# Altium schematic sheet FPGA_IO.SchDoc
size A3
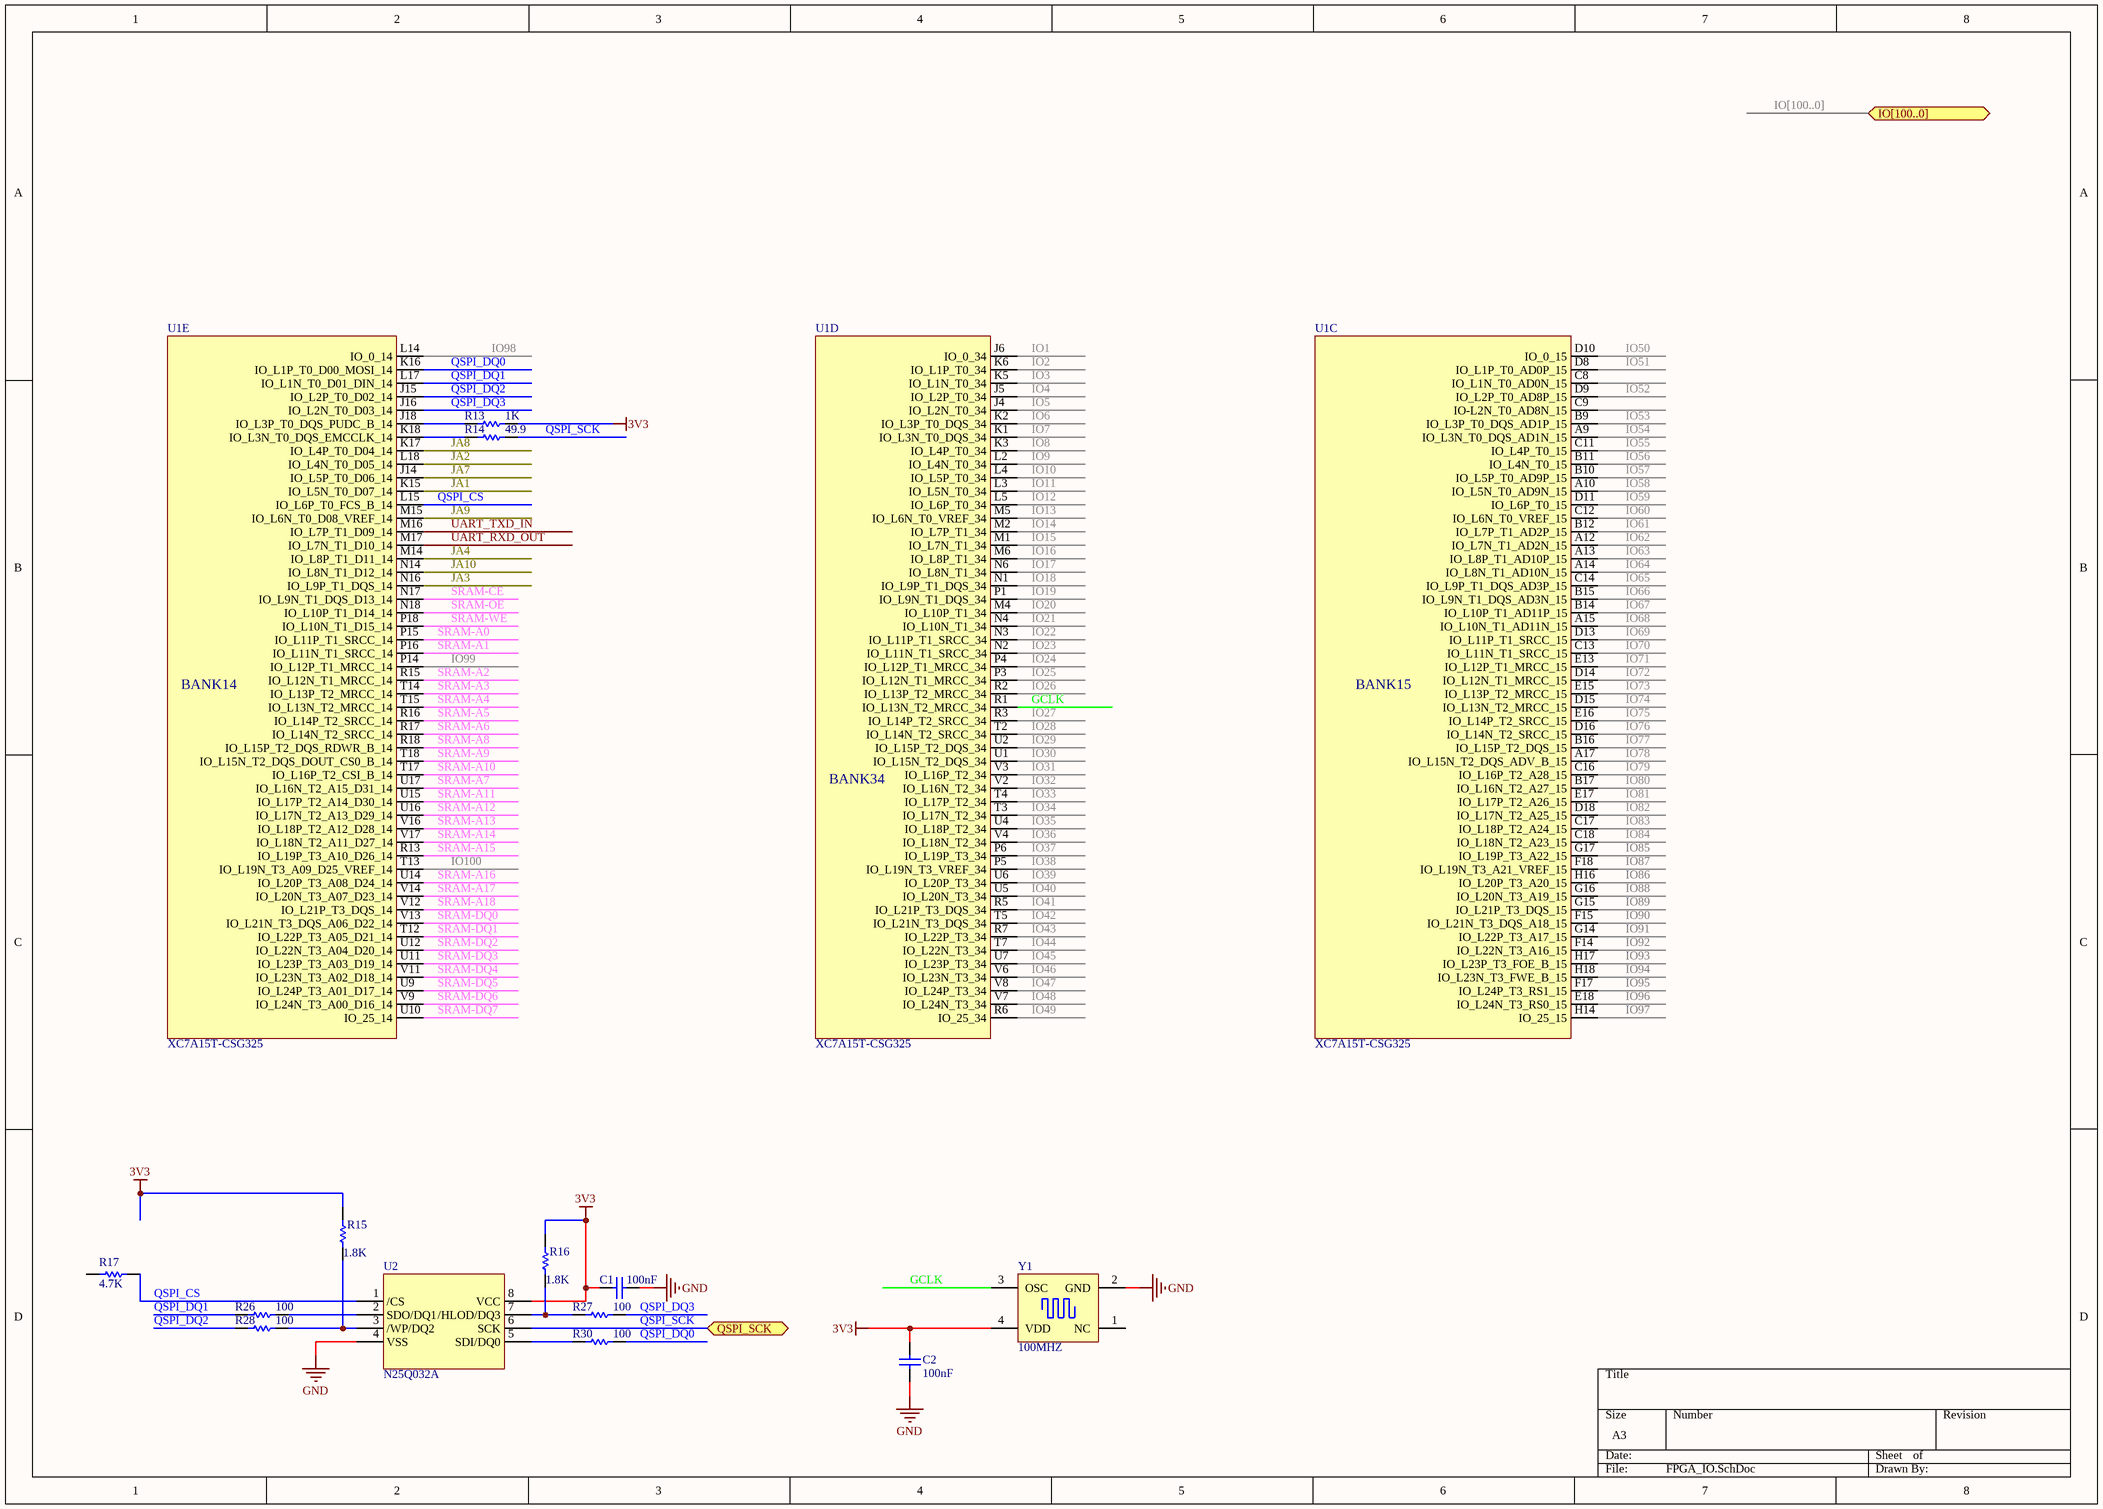
[diagram p0: FPGA_IO.SchDoc]

## Parts
C1  value 100nF  [C2012]  (hidden comment: Cap)
C2  value 100nF  [C2012]  (hidden comment: Cap)
R13  value 1K  [R2012]  (hidden comment: Res)
R14  value 49.9  [R2012]  (hidden comment: Res)
R15  value 1.8K  [R2012]  (hidden comment: Res)
R16  value 1.8K  [R2012]  (hidden comment: Res)
R17  value 4.7K  [R2012]  (hidden comment: Res)
R26  value 100  [R2012]  (hidden comment: Res)
R27  value 100  [R2012]  (hidden comment: Res)
R28  value 100  [R2012]  (hidden comment: Res)
R30  value 100  [R2012]  (hidden comment: Res)
U1  XC7A15T-CSG325  [BGA100P9X9-81A]  (parts C,D,E of 7)
U2  N25Q032A
Y1  100MHZ  [XTAL7_3225]

## Ports
IO[100..0], QSPI_SCK

## Nets
3V3: C1.1 C2.2 R13.1 R15.1 R16.1 U2.8(VCC) Y1.4(VDD)
GND: C1.2 C2.1 U2.4(VSS) Y1.2(GND)
GCLK: U1.R1(IO_L13N_T2_MRCC_34) Y1.3(OSC)
IO1: U1.J6(IO_0_34)
IO2: U1.K6(IO_L1P_T0_34)
IO3: U1.K5(IO_L1N_T0_34)
IO4: U1.J5(IO_L2P_T0_34)
IO5: U1.J4(IO_L2N_T0_34)
IO6: U1.K2(IO_L3P_T0_DQS_34)
IO7: U1.K1(IO_L3N_T0_DQS_34)
IO8: U1.K3(IO_L4P_T0_34)
IO9: U1.L2(IO_L4N_T0_34)
IO10: U1.L4(IO_L5P_T0_34)
IO11: U1.L3(IO_L5N_T0_34)
IO12: U1.L5(IO_L6P_T0_34)
IO13: U1.M5(IO_L6N_T0_VREF_34)
IO14: U1.M2(IO_L7P_T1_34)
IO15: U1.M1(IO_L7N_T1_34)
IO16: U1.M6(IO_L8P_T1_34)
IO17: U1.N6(IO_L8N_T1_34)
IO18: U1.N1(IO_L9P_T1_DQS_34)
IO19: U1.P1(IO_L9N_T1_DQS_34)
IO20: U1.M4(IO_L10P_T1_34)
IO21: U1.N4(IO_L10N_T1_34)
IO22: U1.N3(IO_L11P_T1_SRCC_34)
IO23: U1.N2(IO_L11N_T1_SRCC_34)
IO24: U1.P4(IO_L12P_T1_MRCC_34)
IO25: U1.P3(IO_L12N_T1_MRCC_34)
IO26: U1.R2(IO_L13P_T2_MRCC_34)
IO27: U1.R3(IO_L14P_T2_SRCC_34)
IO28: U1.T2(IO_L14N_T2_SRCC_34)
IO29: U1.U2(IO_L15P_T2_DQS_34)
IO30: U1.U1(IO_L15N_T2_DQS_34)
IO31: U1.V3(IO_L16P_T2_34)
IO32: U1.V2(IO_L16N_T2_34)
IO33: U1.T4(IO_L17P_T2_34)
IO34: U1.T3(IO_L17N_T2_34)
IO35: U1.U4(IO_L18P_T2_34)
IO36: U1.V4(IO_L18N_T2_34)
IO37: U1.P6(IO_L19P_T3_34)
IO38: U1.P5(IO_L19N_T3_VREF_34)
IO39: U1.U6(IO_L20P_T3_34)
IO40: U1.U5(IO_L20N_T3_34)
IO41: U1.R5(IO_L21P_T3_DQS_34)
IO42: U1.T5(IO_L21N_T3_DQS_34)
IO43: U1.R7(IO_L22P_T3_34)
IO44: U1.T7(IO_L22N_T3_34)
IO45: U1.U7(IO_L23P_T3_34)
IO46: U1.V6(IO_L23N_T3_34)
IO47: U1.V8(IO_L24P_T3_34)
IO48: U1.V7(IO_L24N_T3_34)
IO49: U1.R6(IO_25_34)
IO50: U1.D10(IO_0_15)
IO51: U1.D8(IO_L1P_T0_AD0P_15)
IO52: U1.D9(IO_L2P_T0_AD8P_15)
IO53: U1.B9(IO_L3P_T0_DQS_AD1P_15)
IO54: U1.A9(IO_L3N_T0_DQS_AD1N_15)
IO55: U1.C11(IO_L4P_T0_15)
IO56: U1.B11(IO_L4N_T0_15)
IO57: U1.B10(IO_L5P_T0_AD9P_15)
IO58: U1.A10(IO_L5N_T0_AD9N_15)
IO59: U1.D11(IO_L6P_T0_15)
IO60: U1.C12(IO_L6N_T0_VREF_15)
IO61: U1.B12(IO_L7P_T1_AD2P_15)
IO62: U1.A12(IO_L7N_T1_AD2N_15)
IO63: U1.A13(IO_L8P_T1_AD10P_15)
IO64: U1.A14(IO_L8N_T1_AD10N_15)
IO65: U1.C14(IO_L9P_T1_DQS_AD3P_15)
IO66: U1.B15(IO_L9N_T1_DQS_AD3N_15)
IO67: U1.B14(IO_L10P_T1_AD11P_15)
IO68: U1.A15(IO_L10N_T1_AD11N_15)
IO69: U1.D13(IO_L11P_T1_SRCC_15)
IO70: U1.C13(IO_L11N_T1_SRCC_15)
IO71: U1.E13(IO_L12P_T1_MRCC_15)
IO72: U1.D14(IO_L12N_T1_MRCC_15)
IO73: U1.E15(IO_L13P_T2_MRCC_15)
IO74: U1.D15(IO_L13N_T2_MRCC_15)
IO75: U1.E16(IO_L14P_T2_SRCC_15)
IO76: U1.D16(IO_L14N_T2_SRCC_15)
IO77: U1.B16(IO_L15P_T2_DQS_15)
IO78: U1.A17(IO_L15N_T2_DQS_ADV_B_15)
IO79: U1.C16(IO_L16P_T2_A28_15)
IO80: U1.B17(IO_L16N_T2_A27_15)
IO81: U1.E17(IO_L17P_T2_A26_15)
IO82: U1.D18(IO_L17N_T2_A25_15)
IO83: U1.C17(IO_L18P_T2_A24_15)
IO84: U1.C18(IO_L18N_T2_A23_15)
IO85: U1.G17(IO_L19P_T3_A22_15)
IO86: U1.H16(IO_L20P_T3_A20_15)
IO87: U1.F18(IO_L19N_T3_A21_VREF_15)
IO88: U1.G16(IO_L20N_T3_A19_15)
IO89: U1.G15(IO_L21P_T3_DQS_15)
IO90: U1.F15(IO_L21N_T3_DQS_A18_15)
IO91: U1.G14(IO_L22P_T3_A17_15)
IO92: U1.F14(IO_L22N_T3_A16_15)
IO93: U1.H17(IO_L23P_T3_FOE_B_15)
IO94: U1.H18(IO_L23N_T3_FWE_B_15)
IO95: U1.F17(IO_L24P_T3_RS1_15)
IO96: U1.E18(IO_L24N_T3_RS0_15)
IO97: U1.H14(IO_25_15)
IO98: U1.L14(IO_0_14)
IO99: U1.P14(IO_L12P_T1_MRCC_14)
IO100: U1.T13(IO_L19N_T3_A09_D25_VREF_14)
JA1: U1.K15(IO_L5N_T0_D07_14)
JA2: U1.L18(IO_L4N_T0_D05_14)
JA3: U1.N16(IO_L9P_T1_DQS_14)
JA4: U1.M14(IO_L8P_T1_D11_14)
JA7: U1.J14(IO_L5P_T0_D06_14)
JA8: U1.K17(IO_L4P_T0_D04_14)
JA9: U1.M15(IO_L6N_T0_D08_VREF_14)
JA10: U1.N14(IO_L8N_T1_D12_14)
QSPI_CS: R17.1 U1.L15(IO_L6P_T0_FCS_B_14) U2.1(/CS)
QSPI_DQ0: R30.1 U1.K16(IO_L1P_T0_D00_MOSI_14)
QSPI_DQ1: R26.2 U1.L17(IO_L1N_T0_D01_DIN_14)
QSPI_DQ2: R28.2 U1.J15(IO_L2P_T0_D02_14)
QSPI_DQ3: R27.1 U1.J16(IO_L2N_T0_D03_14)
QSPI_SCK: R14.1 U2.6(SCK) ; port QSPI_SCK
SRAM-A0: U1.P15(IO_L11P_T1_SRCC_14)
SRAM-A1: U1.P16(IO_L11N_T1_SRCC_14)
SRAM-A2: U1.R15(IO_L12N_T1_MRCC_14)
SRAM-A3: U1.T14(IO_L13P_T2_MRCC_14)
SRAM-A4: U1.T15(IO_L13N_T2_MRCC_14)
SRAM-A5: U1.R16(IO_L14P_T2_SRCC_14)
SRAM-A6: U1.R17(IO_L14N_T2_SRCC_14)
SRAM-A7: U1.U17(IO_L16N_T2_A15_D31_14)
SRAM-A8: U1.R18(IO_L15P_T2_DQS_RDWR_B_14)
SRAM-A9: U1.T18(IO_L15N_T2_DQS_DOUT_CS0_B_14)
SRAM-A10: U1.T17(IO_L16P_T2_CSI_B_14)
SRAM-A11: U1.U15(IO_L17P_T2_A14_D30_14)
SRAM-A12: U1.U16(IO_L17N_T2_A13_D29_14)
SRAM-A13: U1.V16(IO_L18P_T2_A12_D28_14)
SRAM-A14: U1.V17(IO_L18N_T2_A11_D27_14)
SRAM-A15: U1.R13(IO_L19P_T3_A10_D26_14)
SRAM-A16: U1.U14(IO_L20P_T3_A08_D24_14)
SRAM-A17: U1.V14(IO_L20N_T3_A07_D23_14)
SRAM-A18: U1.V12(IO_L21P_T3_DQS_14)
SRAM-CE: U1.N17(IO_L9N_T1_DQS_D13_14)
SRAM-DQ0: U1.V13(IO_L21N_T3_DQS_A06_D22_14)
SRAM-DQ1: U1.T12(IO_L22P_T3_A05_D21_14)
SRAM-DQ2: U1.U12(IO_L22N_T3_A04_D20_14)
SRAM-DQ3: U1.U11(IO_L23P_T3_A03_D19_14)
SRAM-DQ4: U1.V11(IO_L23N_T3_A02_D18_14)
SRAM-DQ5: U1.U9(IO_L24P_T3_A01_D17_14)
SRAM-DQ6: U1.V9(IO_L24N_T3_A00_D16_14)
SRAM-DQ7: U1.U10(IO_25_14)
SRAM-OE: U1.N18(IO_L10P_T1_D14_14)
SRAM-WE: U1.P18(IO_L10N_T1_D15_14)
UART_RXD_OUT: U1.M17(IO_L7N_T1_D10_14)
UART_TXD_IN: U1.M16(IO_L7P_T1_D09_14)
NetR13_2: R13.2 U1.J18(IO_L3P_T0_DQS_PUDC_B_14)
NetR14_2: R14.2 U1.K18(IO_L3N_T0_DQS_EMCCLK_14)
NetR15_2: R15.2 R28.1 U2.3(/WP/DQ2)
NetR16_2: R16.2 R27.2 U2.7(/HLOD/DQ3)
NetR26_1: R26.1 U2.2(SDO/DQ1)
NetR30_2: R30.2 U2.5(SDI/DQ0)

Not connected (* = marked no-connect by the designer): R17 2; U1 C8(IO_L1N_T0_AD0N_15) C9(IO-L2N_T0_AD8N_15); Y1 1(NC)

## Buses and harness runs
bus IO[100..0] = port IO[100..0]

## Notes on the sheet
- (in symbol XC7A15T-CSG325, part C) BANK15
- (in symbol XC7A15T-CSG325, part D) BANK34
- (in symbol XC7A15T-CSG325, part E) BANK14

## Library data of the parts
C1 C2 = Cap: 贴片电容; Published: 8-Jun-2000; LatestRevisionDate: 17-Jul-2002; LatestRevisionNote: Re-released for DXP Platform.; PackageReference: RAD-0.3; Publisher: Altium Limited
R13-R17 R26-R28 R30 = Res: 贴片电阻; Published: 8-Jun-2000; LatestRevisionDate: 17-Jul-2002; LatestRevisionNote: Re-released for DXP Platform.; PackageReference: AXIAL-0.3; Publisher: Altium Limited
U1 = XC7A15T-CSG325: Artix-7
Y1 = XTAL1